# EasyEDA Pro project ProProject_基于CW32单片机的无刷电机控制器（旋转变压器位置反馈）_2024-06-02.epro, board PCB8
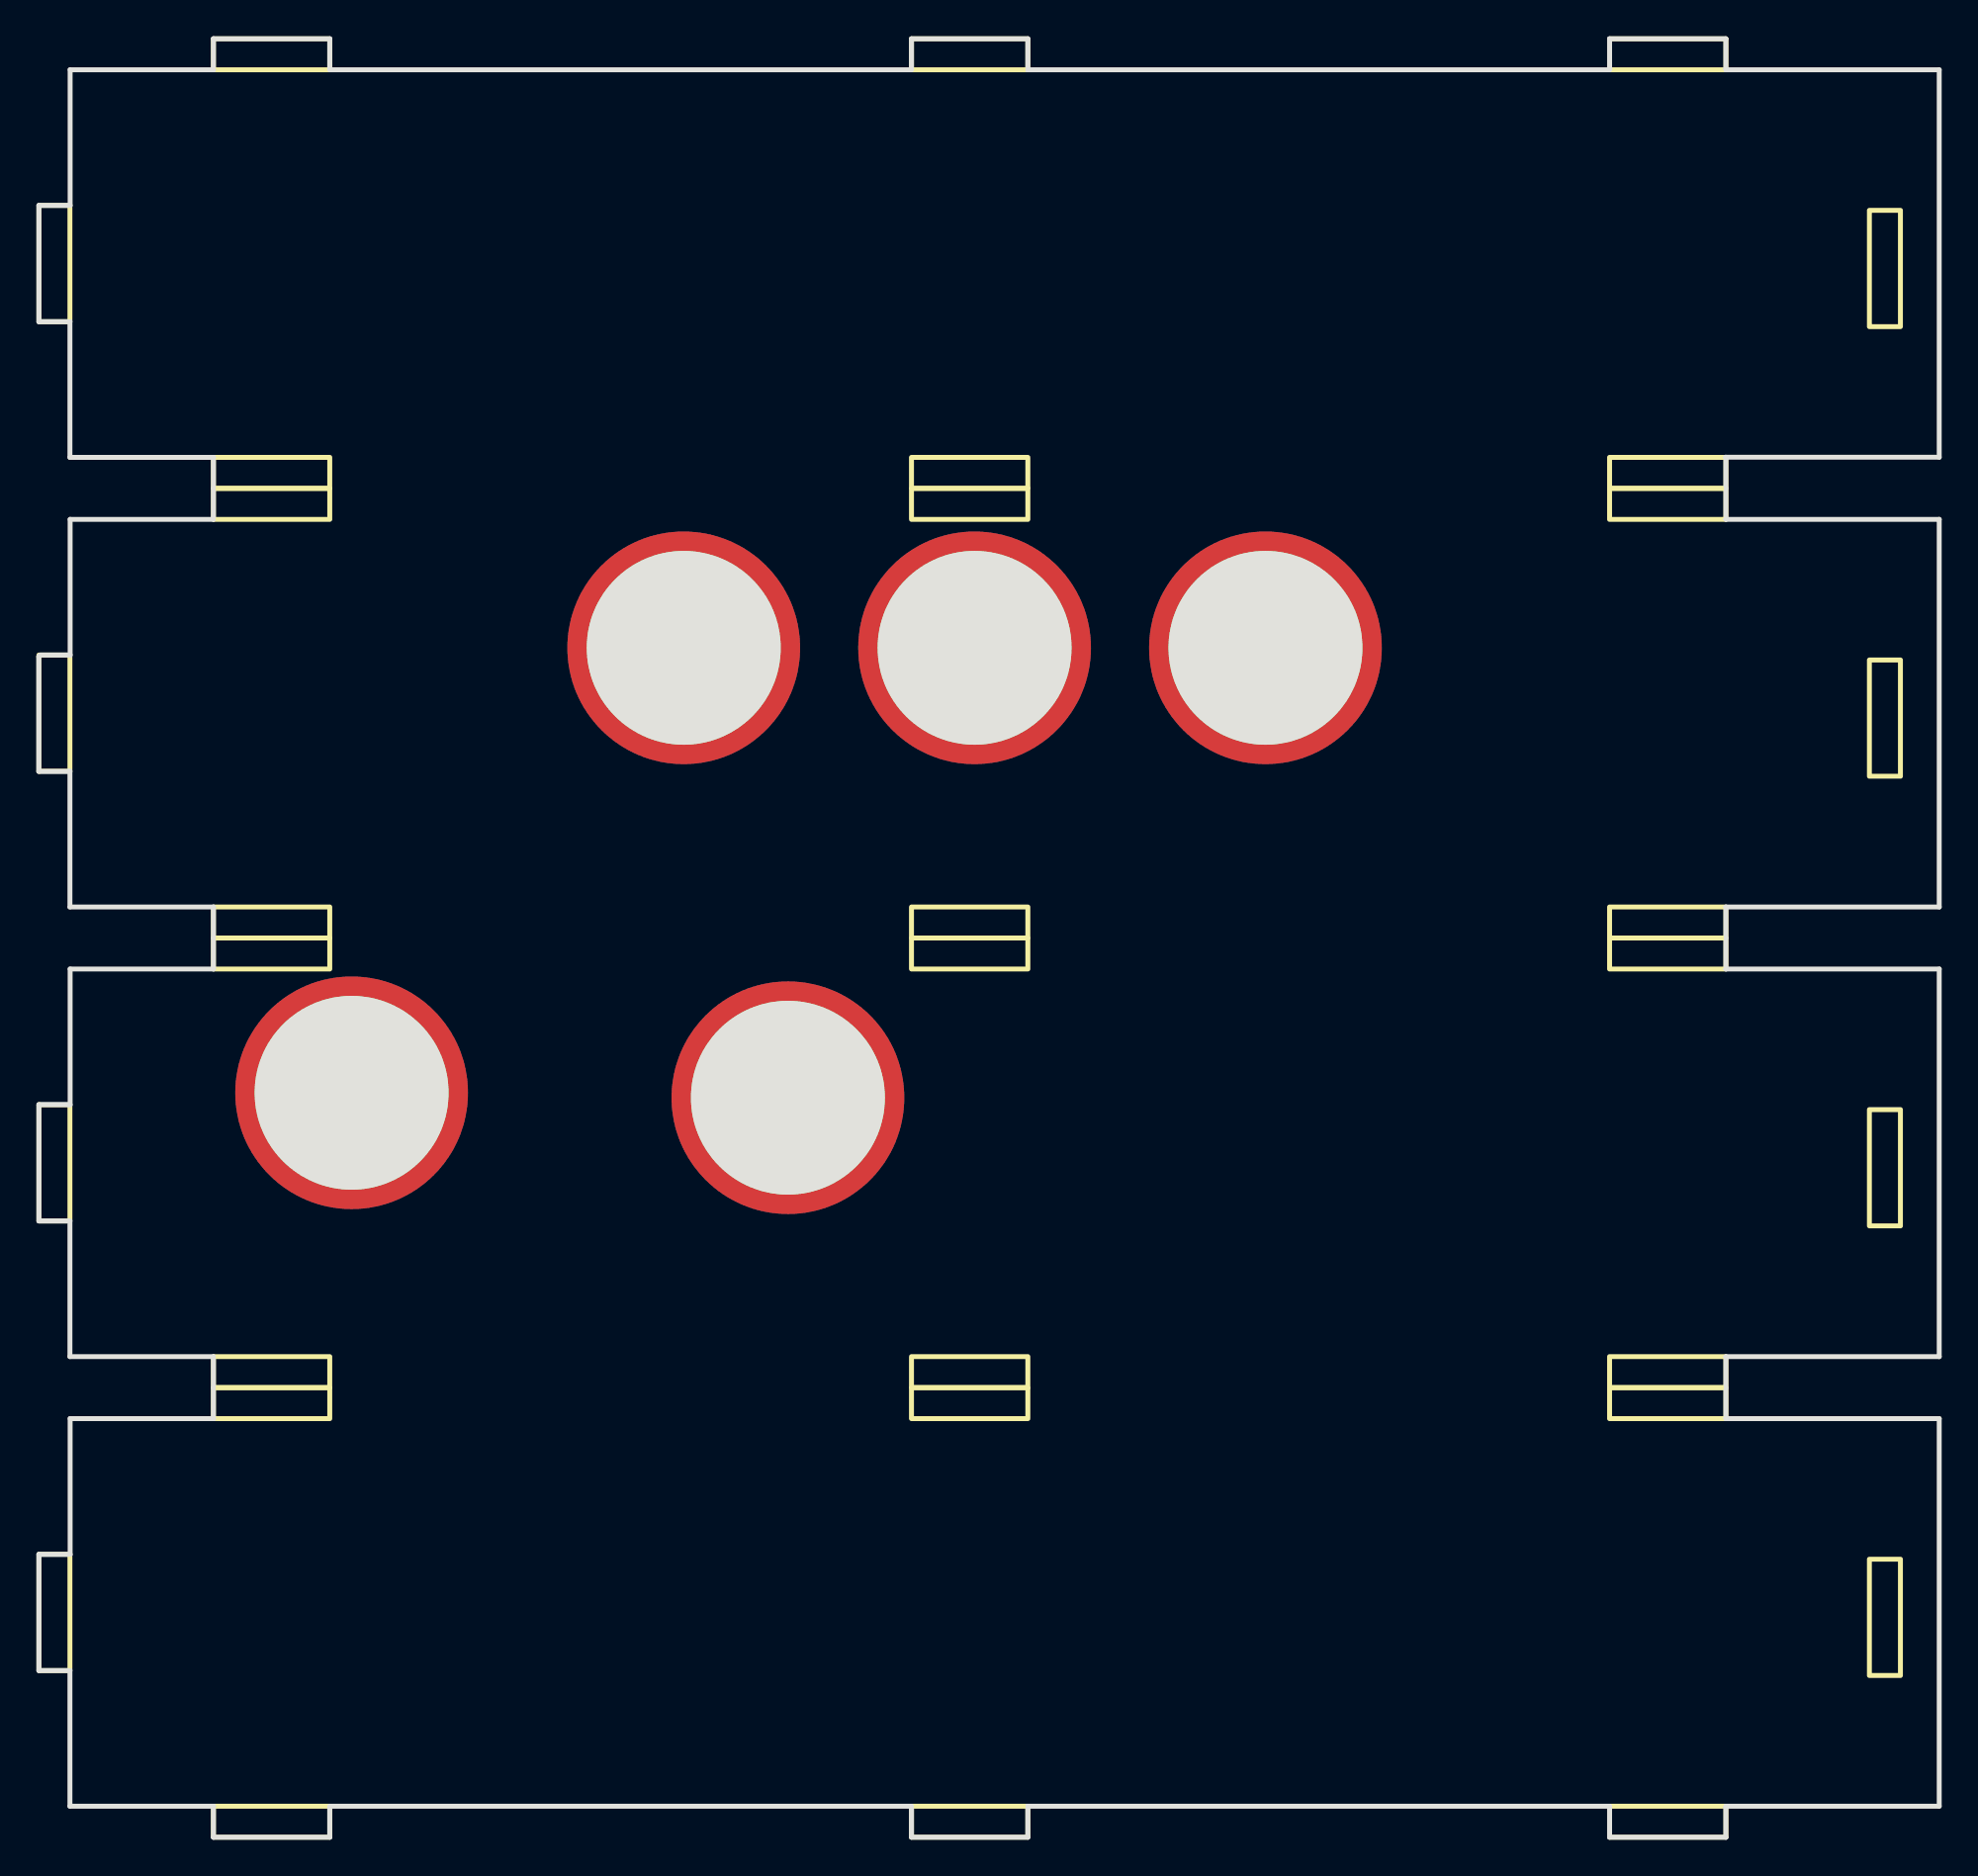
[diagram p8: board, top side]
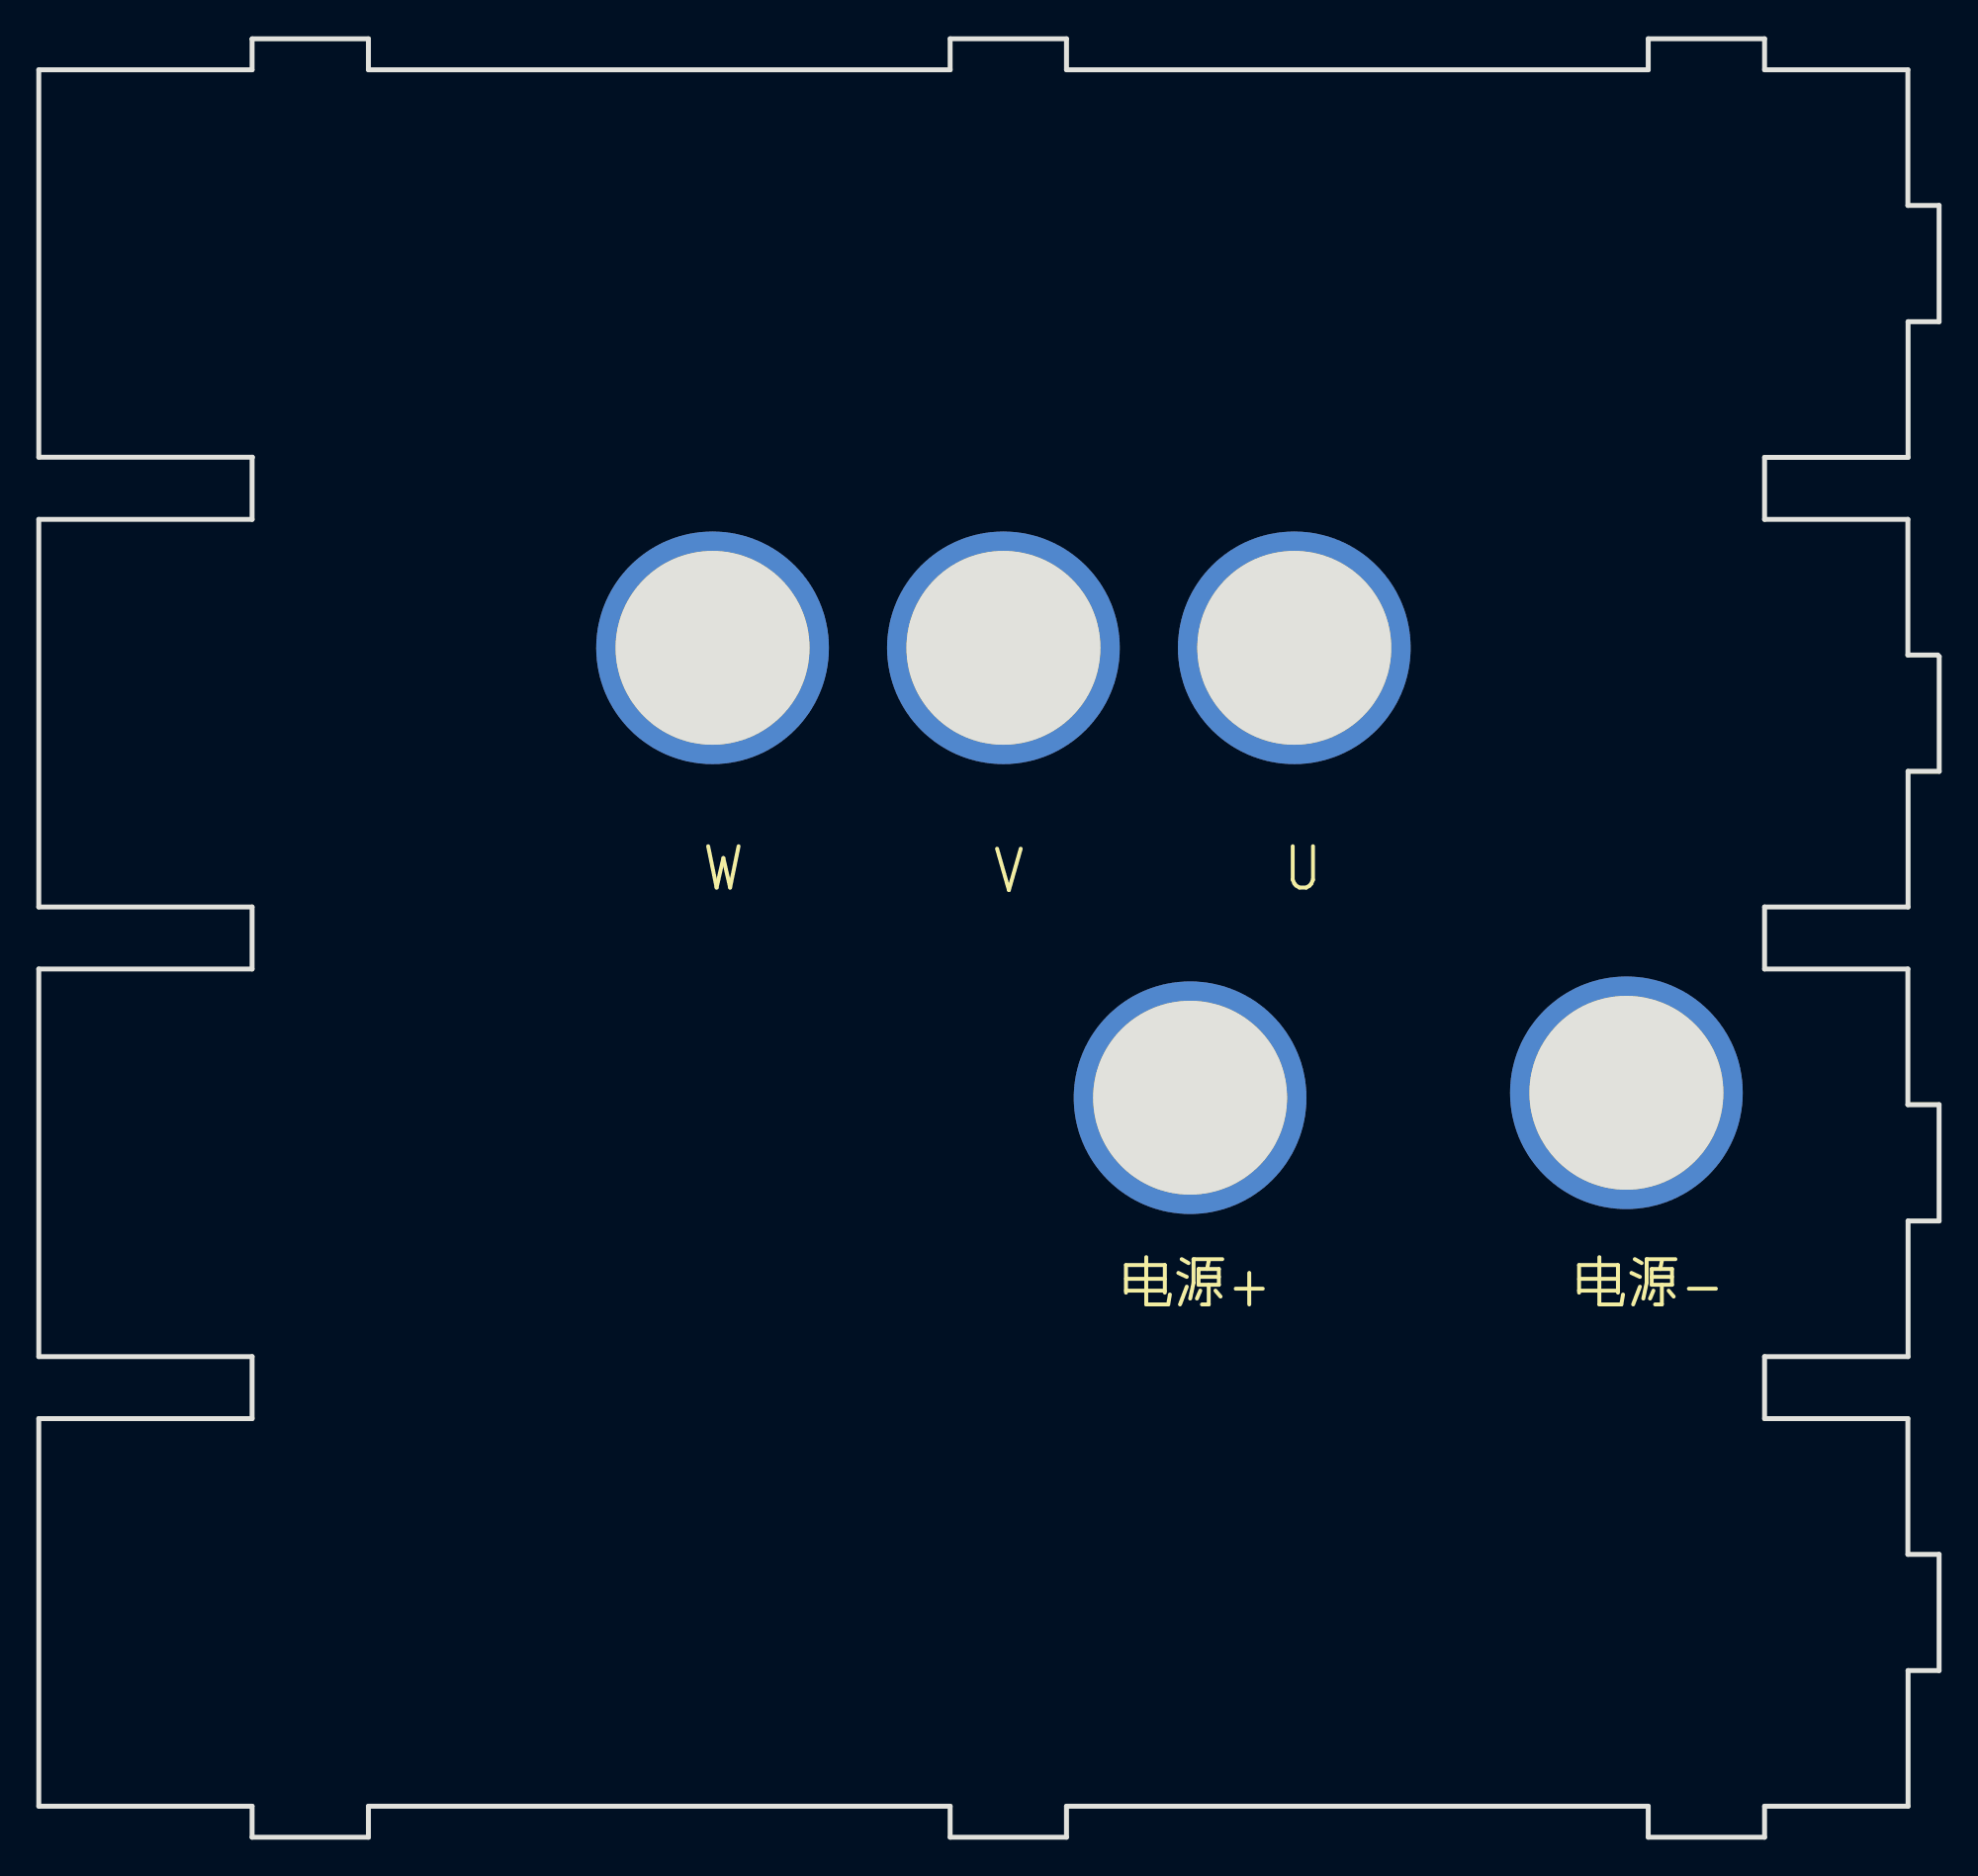
[diagram p9: board, bottom side, seen from below]

Outline 98.01 x 92.8 mm; copper layers: Top Layer, Bottom Layer. Coordinates in mm from the lower left corner of the outline.
Outline path: 0,60.92 0,55 1.61,55 1.61,48 9.01,48 9.01,44.8 1.62,44.8 1.62,37.8 0.01,37.8 0.01,31.8 1.61,31.8 1.61,24.8 9.01,24.8 9.01,21.6 1.62,21.6 1.62,14.6 0.01,14.6 0.01,8.6 1.61,8.6 1.61,1.6 9.01,1.6 9.01,0 15.01,0 15.01,1.6 45.01,1.6 45.01,0 51.01,0 51.01,1.6 81.01,1.6 81.01,0 87.01,0 87.01,1.6 98.01,1.6 98.01,21.6 87.01,21.6 87.01,24.8 98.01,24.8 98.01,44.8 87.01,44.8 87.01,48 98.01,48 98.01,68 87.01,68 87.01,71.2 87,71.21 98.01,71.21 98.01,91.2 87.01,91.2 87.01,92.79 87,92.8 81.01,92.8 81.01,91.2 51.01,91.2 51.01,92.8 45.01,92.8 45.01,91.2 15.01,91.2 15.01,91.21 15.01,92.8 9.01,92.8 9.01,91.2 1.62,91.2 1.62,84.2 0.01,84.2 0.01,78.2 1.61,78.2 1.61,71.2 9.01,71.2 9.01,68 1.62,68 1.62,61 0.08,61 0,60.92
Stack: Top Layer 0.035mm / Dielectric1 1.51mm FR4 er 4.5 / Bottom Layer 0.035mm

## Design rules (mm)
template: JLCPCB Capability(Two Layers Board)
spacing copperThickness1oz (default): track to track 0.102, other pairs 0.152 to 0.3
spacing copperThickness2oz: track to track 0.203, other pairs 0.152 to 0.3
track width copperThickness1oz (default): min 0.127, default 0.254, max 2.54
track width copperThickness2oz: min 0.203, default 0.254, max 2.54
differential pair differentialPair (default): width min 0.127, default 0.254, max 2.54; gap min 0.152, default 0.152
via viaSize (default): diameter min 0.5, default 0.61, max 10; hole min 0.3, default 0.305, max 6.3

## Placement (name value [footprint] x y rotation side)
TP1  -  [m2螺丝]  33.26 61.37 0 top
TP2  -  [m2螺丝]  38.63 38.16 0 top
TP2#2  -  [m2螺丝]  63.26 61.37 0 top
TP3  -  [m2螺丝]  48.26 61.37 0 top
TP3#2  -  [m2螺丝]  16.13 38.41 0 top

## Footprints (pads in the part's own frame, mm; a bottom-side part is the same pattern mirrored in y, then rotated)
m2螺丝
  round 12 hole 10x6: 1(0,0)

## Nets
As in the schematic.

Pads without a net: TP1 1; TP2 1; TP2#2 1; TP3 1; TP3#2 1

## Text on the board
Bottom Silkscreen Layer: U | V | W | 电源- | 电源+
